# EAGLE design mylcdwithencoder-panel-pcb (EAGLE 6.5.0)
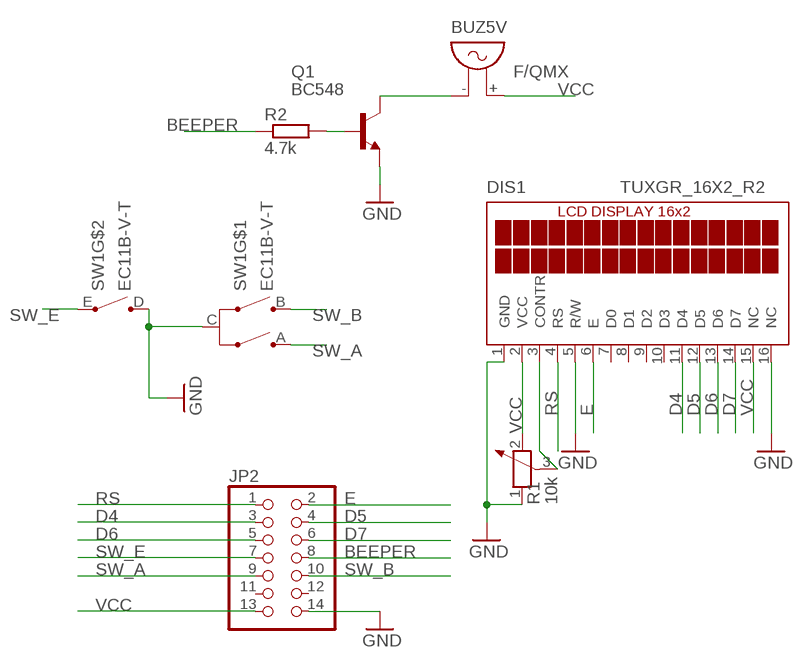
[diagram p0: schematic, sheet 1]

## Parts
BUZ5V  F/QMX  [F/QMX]
DIS1  TUXGR_16X2_R2  [TUXGR_16X2_R2]
JP2  PINHD-2X7  [2X07]
Q1  BC548  [TO92-EBC]
R1  10k  POTENTIOMETER_PT-10  [PT-10]
R2  4.7k  R-EU_0207/10  [0207/10]
SW1  EC11B-V-T  [EC11B-V]

## Nets
BEEPER: JP2.8 R2.1
D4: DIS1.11(D4) JP2.3
D5: DIS1.12(D5) JP2.4
D6: DIS1.13(D6) JP2.5
D7: DIS1.14(D7) JP2.6
E: DIS1.6(E) JP2.2
GND: DIS1.1(GND) DIS1.5(R/W) DIS1.16(NC) JP2.14 Q1.E R1.1 SW1.C SW1.D
N$1: DIS1.3(CONTR) R1.3
N$12: Q1.B R2.2
N$13: BUZ5V.- Q1.C
RS: DIS1.4(RS) JP2.1
SW_A: JP2.9 SW1.A
SW_B: JP2.10 SW1.B
SW_E: JP2.7 SW1.E
VCC: BUZ5V.+ DIS1.2(VCC) DIS1.15(NC) JP2.13 R1.2
Unconnected: DIS1.7(D0) DIS1.8(D1) DIS1.9(D2) DIS1.10(D3) JP2.11 JP2.12

## Library data of the parts
BUZ5V = buzzer:F/QMX: BUZZER Source: Buerklin; OC_FARNELL: unknown; OC_NEWARK: unknown
DIS1 = display-lcd:TUXGR_16X2_R2: Tuxgraphics LCD display 16x2 characters reflective, without background light Source: tuxgr_12x2_r2.pdf; OC_FARNELL: unknown; OC_NEWARK: unknown
JP2 = pinhead:PINHD-2X7: PIN HEADER
Q1 = transistor-npn:BC548*: NPN Transistor
R1 = rcl:POTENTIOMETER_: Potentiometer
R2 = rcl:R-EU_: RESISTOR, European symbol
SW1 = alps:EC11B-V-T: ALPS EC11B Vertikal mit Taster Drehimpulsgeber 11mm

## Board
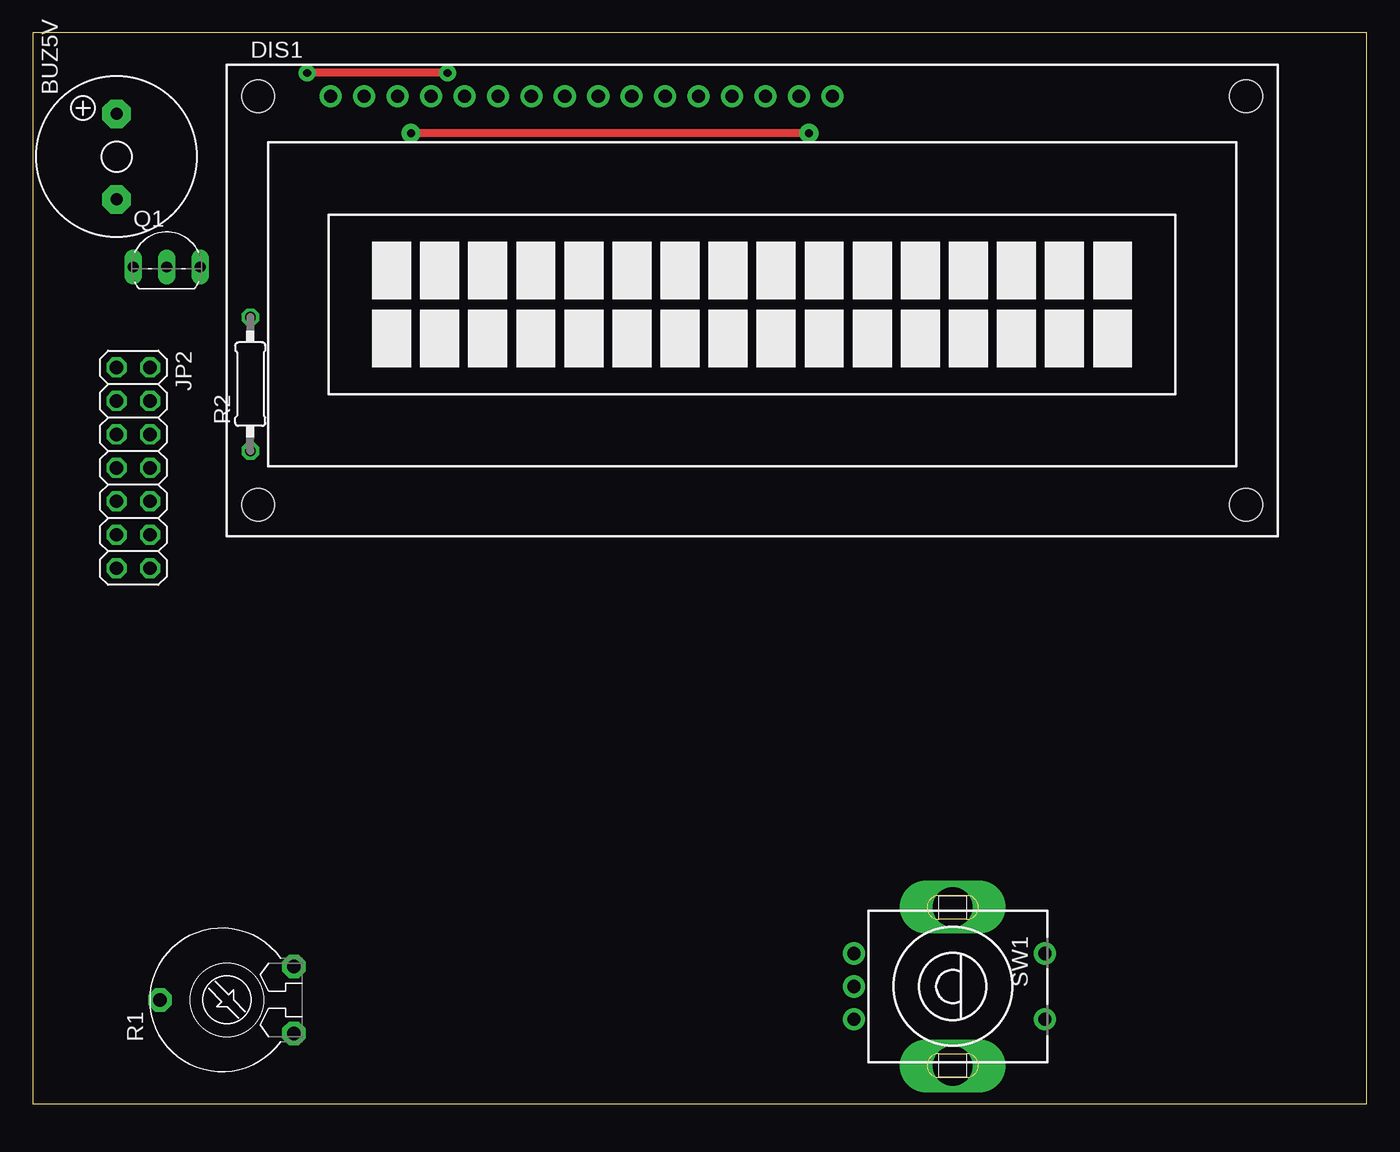
[diagram p1: board, top side]
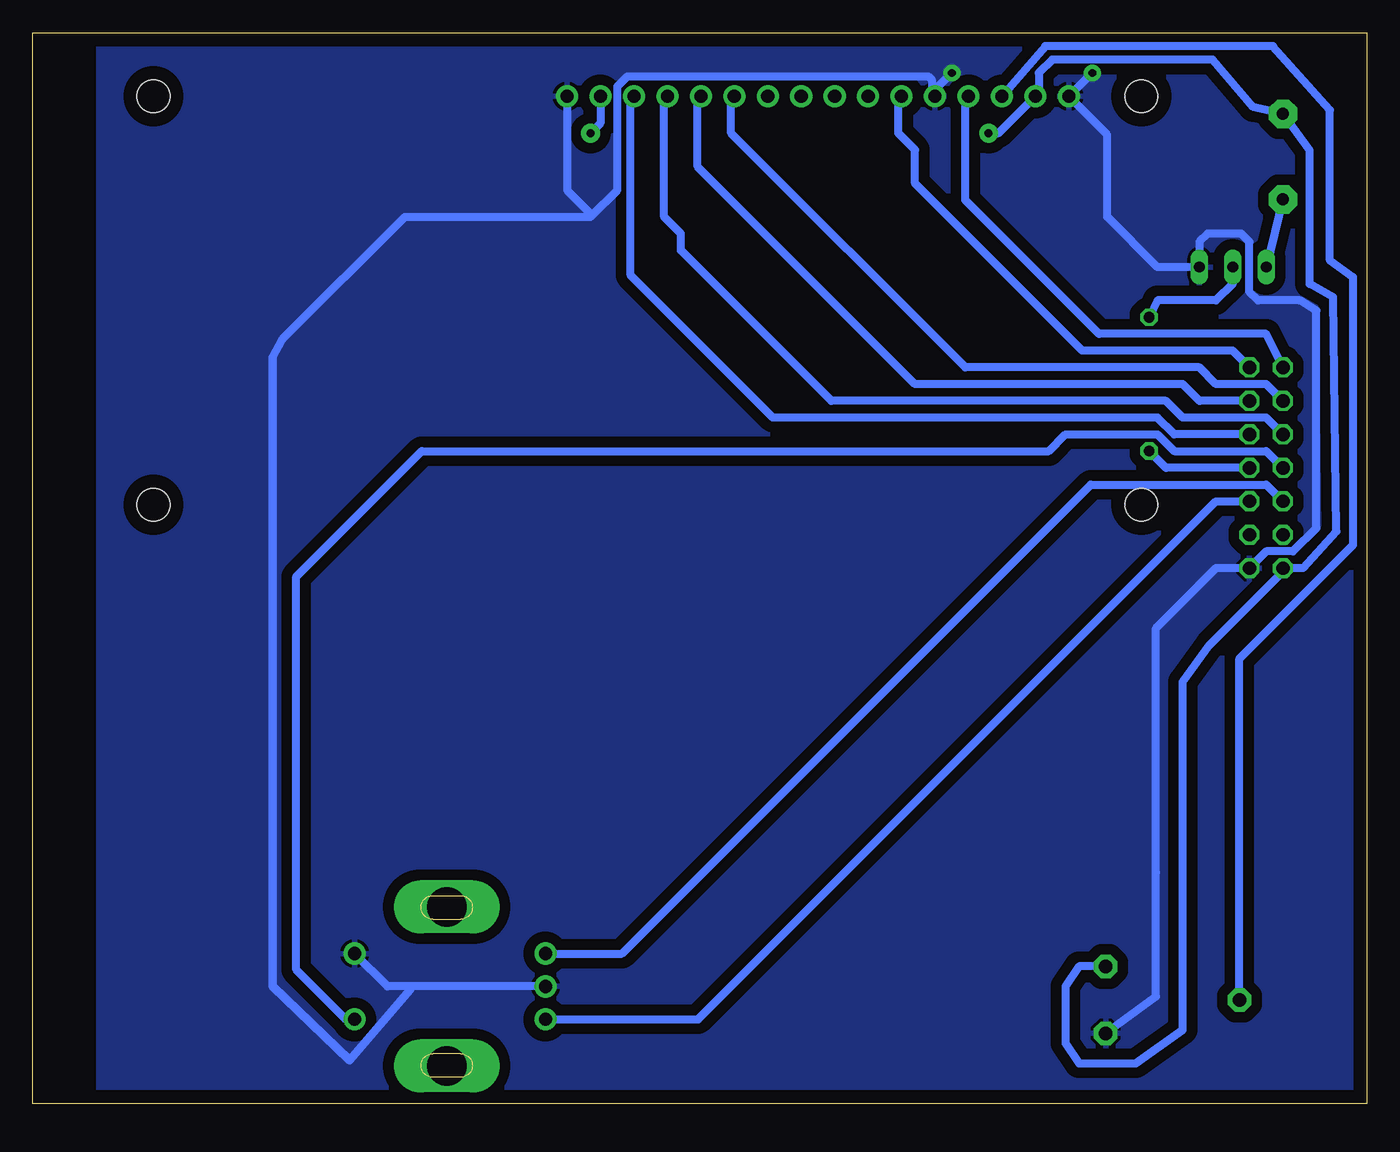
[diagram p2: board, bottom side, seen from below]

Size 101.27 x 81.27 mm. Coordinates in mm from the lower left corner, seen from the top.
Outline: 0,0 101.27,0 101.27,81.27 0,81.27 0,0
Copper layers (1*16): Top 0.035mm / dielectric 1.5mm / Bottom 0.035mm
Design rules "default *": minimum track width 25mil, minimum drill 24mil, track to track 10mil, track to pad 8mil, pad to pad 8mil, via to via 10mil, smd to smd 8mil, copper to edge 40mil, drill to drill 8mil, minimum pad ring 10mil, minimum via ring 8mil, stop-mask expansion 4mil, vias tented up to drill 0mil, thermal gap 10mil

### Footprints (pad centres in the part's own frame; a part is rotated, then mirrored left to right if it is on the bottom)
F/QMX = drill 0.914 pad 2.159 octagon: + 3.251,0; - -3.251,0
TUXGR_16X2_R2 = drill 1 pad 1.676: 1 -32,15.5; 2 -29.46,15.5; 3 -26.92,15.5; 4 -24.38,15.5; 5 -21.84,15.5; 6 -19.3,15.5; 7 -16.76,15.5; 8 -14.22,15.5; 9 -11.68,15.5; 10 -9.14,15.5; 11 -6.6,15.5; 12 -4.06,15.5; 13 -1.52,15.5; 14 1.02,15.5; 15 3.56,15.5; 16 6.1,15.5 | hole 2.5: -37.5,-15.5; 37.5,-15.5; -37.5,15.5; 37.5,15.5
2X07 = drill 1.016 octagon: 1 -7.62,-1.27; 2 -7.62,1.27; 3 -5.08,-1.27; 4 -5.08,1.27; 5 -2.54,-1.27; 6 -2.54,1.27; 7 0,-1.27; 8 0,1.27; 9 2.54,-1.27; 10 2.54,1.27; 11 5.08,-1.27; 12 5.08,1.27; 13 7.62,-1.27; 14 7.62,1.27
TO92-EBC = drill 0.813 long: B 0,-1.27; C -2.54,-1.27; E 2.54,-1.27
PT-10 = drill 1.016 pad 1.778 octagon: 1 -2.54,-5.08; 2 2.54,-5.08; 3 0,5.08
0207/10 = drill 0.813 octagon: 1 -5.08,0; 2 5.08,0
EC11B-V = drill 1 pad 1.676: A -2.5,-7.5; B 2.5,-7.5; C 0,-7.5; D -2.5,7; E 2.5,7 | drill 3 pad 3.3 long: G1 -6.032,0; G2 6.032,0

### Placement (x,y rotation side)
BUZ5V  6.35,71.88 90 top
DIS1  54.61,60.96 0 top
JP2  7.62,48.26 270 top
Q1  10.16,64.77 0 top
R1  14.73,7.87 90 top
R2  16.51,54.61 90 top
SW1  69.85,8.89 270 top

### Tracks (layer width: path | path; a pad name or v marks a point on that pad's centre or on a via)
BEEPER
  Bottom 0.61: JP2.8 15.24,48.26 R2.1
D4
  Bottom 0.61: JP2.3 7.62,54.61 11.43,54.61 12.7,55.88 30.48,55.88 48.26,73.66 48.26,76.21 DIS1.11
D5
  Bottom 0.61: JP2.4 12.7,53.34 13.97,54.61 34.29,54.61 50.8,71.12 50.8,76.21 DIS1.12
D6
  Bottom 0.61: JP2.5 7.62,52.07 13.97,52.07 15.24,53.34 40.64,53.34 52.07,64.77 52.07,66.04 53.34,67.31 53.34,76.21 DIS1.13
D7
  Bottom 0.61: JP2.6 14.61,50.8 15.88,52.07 45.09,52.07 55.88,62.87 55.88,76.21 DIS1.14
E
  Bottom 0.61: JP2.2 10.16,57.15 21.59,57.15 34.29,69.85 34.29,72.39 35.56,73.66 35.56,76.21 DIS1.6
GND  (via drill 0.6 pad 1.27)
  Top 0.61: v31.5,78.23 v20.83,78.23
  Bottom 0.61: SW1.C 72.64,8.89 74.35,8.89 SW1.D | 83.06,56.64 82.3,58.04 73.03,67.31 58.93,67.31 58.8,67.44 | R1.1 16,8.13 16,17.53 16,36.07 11.43,40.64 JP2.14 7.62,41.91 5.59,41.91 3.81,43.69 3.81,60.2 5.08,60.96 8.26,60.96 8.89,61.59 8.89,65.41 9.53,66.04 12.06,66.04 12.7,65.41 Q1.E 15.88,63.5 19.68,67.31 19.68,73.53 DIS1.1 v20.84,78.23 v20.83,78.23 | 58.8,67.44 56.9,69.34 56.9,77.22 56.13,77.98 33.27,77.98 33.02,77.72 33.02,76.71 DIS1.5 32.77,76.96 v31.5,78.23 | DIS1.16 60.71,69.35 58.8,67.44
  Bottom 0.635: 83.06,56.64 83.06,8.89 77.22,3.3 72.64,8.64 72.64,8.89
  pour Bottom (isolate 0.813): 0,0 96.27,0 96.27,81.28 0,81.28
N$1
  Bottom 0.61: R1.3 9.65,33.78 1.02,42.42 1.02,62.74 2.79,64.01 2.79,75.44 7.11,80.26 24.39,80.26 DIS1.3
N$12
  Bottom 0.61: Q1.B 10.16,62.23 11.43,60.96 15.88,60.96 R2.2
N$13
  Bottom 0.61: BUZ5V.- Q1.C
RS
  Bottom 0.61: JP2.1 7.62,58.42 20.32,58.42 30.48,68.58 30.48,76.21 DIS1.4
SW_A
  Bottom 0.61: SW1.A 56.55,11.39 20.95,46.99 7.62,46.99 JP2.9
SW_B
  Bottom 0.61: SW1.B 50.76,6.39 11.43,45.72 JP2.10
SW_E
  Bottom 0.61: SW1.E 77.51,6.39 81.28,10.16 81.28,40.01 71.75,49.53 24.13,49.53 22.86,50.8 15.88,50.8 14.61,49.53 7.62,49.53 JP2.7
VCC  (via drill 0.6 pad 1.42)
  Top 0.61: v58.93,73.66 v28.7,73.66
  Bottom 0.61: R1.2 21.84,10.41 22.86,8.89 22.86,4.57 21.84,3.05 17.53,3.05 13.97,5.59 13.97,32 11.94,34.8 6.35,40.39 JP2.13 4.83,40.64 2.29,43.43 2.54,61.21 4.32,62.23 4.32,72.34 BUZ5V.+ 8.59,75.64 11.68,79.25 23.88,79.25 24.89,78.23 24.89,76.72 DIS1.2 27.95,73.66 v28.7,73.66 | DIS1.15 58.17,74.42 v58.93,73.66